# EAGLE schematic fluke845_refboard (EAGLE 7.4.0)
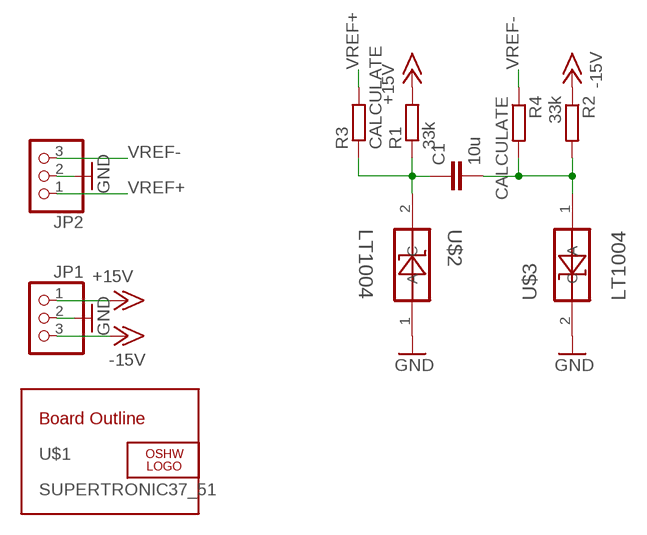
[diagram p0: schematic, sheet 1]

## Parts
C1  10u  C-EUC0805  [C0805]
JP1  PINHD-1X3TH_SMALL  [1X03_SMALL]
JP2  PINHD-1X3TH_SMALL  [1X03_SMALL]
LOGO1  OSHW_LOGO_8MILX0200-NT  [OSHW_8X200_NOTEXT]
R1  33k  R-EU_0207/7  [0207/7]
R2  33k  R-EU_0207/7  [0207/7]
R3  CALCULATE  R-EU_0207/7  [0207/7]
R4  CALCULATE  R-EU_0207/7  [0207/7]
U$1  SUPERTRONIC37_51  [SUPERTRONIC_37_51MM]
U$2  LT1004  [TO92]
U$3  LT1004  [TO92]

## Nets
+15V: JP1.1 R1.2
-15V: JP1.3 R2.1
GND: JP1.2 JP2.2 U$2.1(A) U$3.2(C)
N$1: C1.2 R2.2 R4.2 U$3.1(A)
N$2: C1.1 R1.1 R3.1 U$2.2(C)
VREF+: JP2.1 R3.2
VREF-: JP2.3 R4.1

## Library data of the parts
C1 = SquantorRCL:C-EU: CAPACITOR, European symbol
JP1 JP2 = SquantorConnectors:PINHD-1X3: PIN HEADER
LOGO1 = ohw-logo:OSHW_LOGO_8MIL
R1-R4 = SquantorRCL:R-EU_: RESISTOR, European symbol
U$1 = SquantorPCBOutline:SUPERTRONIC
U$2 U$3 = SquantorLinearTechnology:LT1004